# Altium schematic sheet UROV_ESC_Mounts.SchDoc
size A
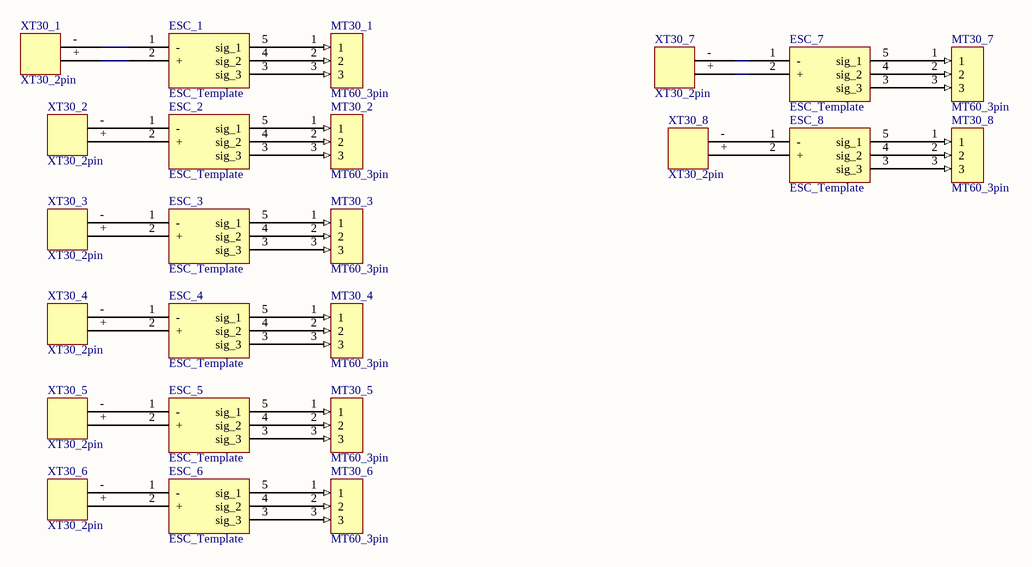
[diagram p0: UROV_ESC_Mounts.SchDoc]

## Parts
ESC_1  ESC_Template  [ESC_mounts]
ESC_2  ESC_Template  [ESC_mounts]
ESC_3  ESC_Template  [ESC_mounts]
ESC_4  ESC_Template  [ESC_mounts]
ESC_5  ESC_Template  [ESC_mounts]
ESC_6  ESC_Template  [ESC_mounts]
ESC_7  ESC_Template  [ESC_mounts]
ESC_8  ESC_Template  [ESC_mounts]
MT30_1  MT60_3pin  [MT60_3pin]
MT30_2  MT60_3pin  [MT60_3pin]
MT30_3  MT60_3pin  [MT60_3pin]
MT30_4  MT60_3pin  [MT60_3pin]
MT30_5  MT60_3pin  [MT60_3pin]
MT30_6  MT60_3pin  [MT60_3pin]
MT30_7  MT60_3pin  [MT60_3pin]
MT30_8  MT60_3pin  [MT60_3pin]
XT30_1  XT30_2pin  [XT30_2pin]
XT30_2  XT30_2pin  [XT30_2pin]
XT30_3  XT30_2pin  [XT30_2pin]
XT30_4  XT30_2pin  [XT30_2pin]
XT30_5  XT30_2pin  [XT30_2pin]
XT30_6  XT30_2pin  [XT30_2pin]
XT30_7  XT30_2pin  [XT30_2pin]
XT30_8  XT30_2pin  [XT30_2pin]

## Nets
NetESC_1_1: ESC_1.1(-) XT30_1.-
NetESC_1_2: ESC_1.2(+) XT30_1.+
NetESC_1_3: ESC_1.3(sig_3) MT30_1.3
NetESC_1_4: ESC_1.4(sig_2) MT30_1.2
NetESC_1_5: ESC_1.5(sig_1) MT30_1.1
NetESC_2_1: ESC_2.1(-) XT30_2.-
NetESC_2_2: ESC_2.2(+) XT30_2.+
NetESC_2_3: ESC_2.3(sig_3) MT30_2.3
NetESC_2_4: ESC_2.4(sig_2) MT30_2.2
NetESC_2_5: ESC_2.5(sig_1) MT30_2.1
NetESC_3_1: ESC_3.1(-) XT30_3.-
NetESC_3_2: ESC_3.2(+) XT30_3.+
NetESC_3_3: ESC_3.3(sig_3) MT30_3.3
NetESC_3_4: ESC_3.4(sig_2) MT30_3.2
NetESC_3_5: ESC_3.5(sig_1) MT30_3.1
NetESC_4_1: ESC_4.1(-) XT30_4.-
NetESC_4_2: ESC_4.2(+) XT30_4.+
NetESC_4_3: ESC_4.3(sig_3) MT30_4.3
NetESC_4_4: ESC_4.4(sig_2) MT30_4.2
NetESC_4_5: ESC_4.5(sig_1) MT30_4.1
NetESC_5_1: ESC_5.1(-) XT30_5.-
NetESC_5_2: ESC_5.2(+) XT30_5.+
NetESC_5_3: ESC_5.3(sig_3) MT30_5.3
NetESC_5_4: ESC_5.4(sig_2) MT30_5.2
NetESC_5_5: ESC_5.5(sig_1) MT30_5.1
NetESC_6_1: ESC_6.1(-) XT30_6.-
NetESC_6_2: ESC_6.2(+) XT30_6.+
NetESC_6_3: ESC_6.3(sig_3) MT30_6.3
NetESC_6_4: ESC_6.4(sig_2) MT30_6.2
NetESC_6_5: ESC_6.5(sig_1) MT30_6.1
NetESC_7_1: ESC_7.1(-) XT30_7.-
NetESC_7_2: ESC_7.2(+) XT30_7.+
NetESC_7_3: ESC_7.3(sig_3) MT30_7.3
NetESC_7_4: ESC_7.4(sig_2) MT30_7.2
NetESC_7_5: ESC_7.5(sig_1) MT30_7.1
NetESC_8_1: ESC_8.1(-) XT30_8.-
NetESC_8_2: ESC_8.2(+) XT30_8.+
NetESC_8_3: ESC_8.3(sig_3) MT30_8.3
NetESC_8_4: ESC_8.4(sig_2) MT30_8.2
NetESC_8_5: ESC_8.5(sig_1) MT30_8.1